# Altium schematic sheet TopSheet.SchDoc
size A
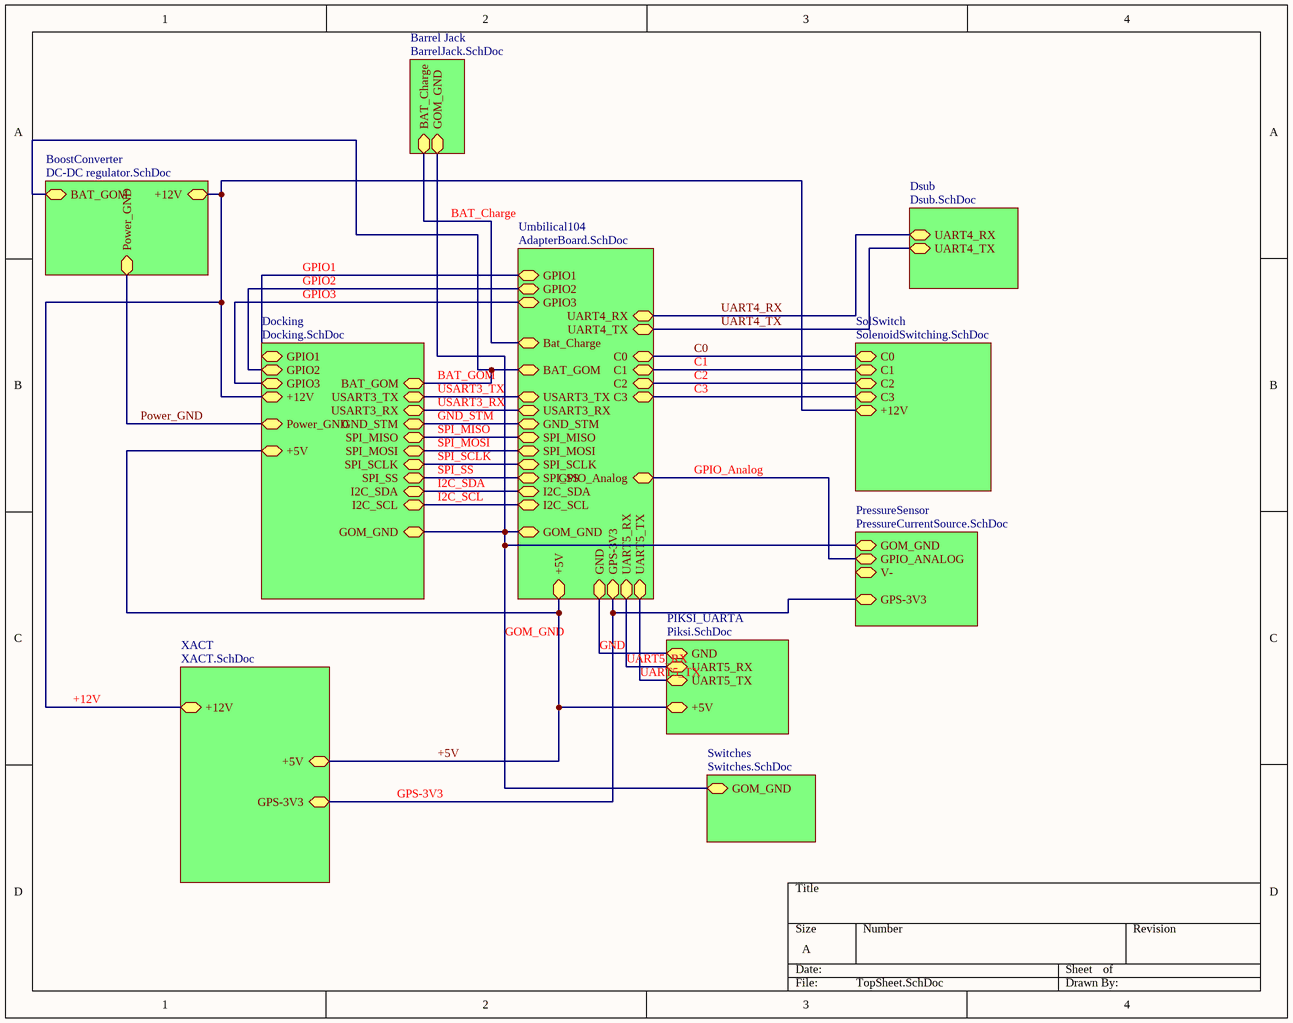
[diagram p0: TopSheet.SchDoc]

## Sub-sheets
Barrel Jack = BarrelJack.SchDoc: GOM_GND (bidir), BAT_Charge (bidir)
BoostConverter = DC-DC regulator.SchDoc: BAT_GOM (bidir), +12V (bidir), Power_GND (bidir)
Docking = Docking.SchDoc: GPIO3 (bidir), GPIO2 (bidir), GPIO1 (bidir), +12V (bidir), Power_GND (bidir), USART3_RX (bidir), GND_STM (bidir), SPI_SCLK (bidir), SPI_MISO (bidir), GOM_GND (bidir), BAT_GOM (bidir), I2C_SCL (bidir), SPI_MOSI (bidir), USART3_TX (bidir), SPI_SS (bidir), +5V (bidir), I2C_SDA (bidir)
Dsub = Dsub.SchDoc: UART4_TX (bidir), UART4_RX (bidir)
PIKSI_UARTA = Piksi.SchDoc: UART5_TX (bidir), UART5_RX (bidir), +5V (bidir), GND (bidir)
PressureSensor = PressureCurrentSource.SchDoc: GOM_GND (bidir), V- (bidir), GPIO_ANALOG (bidir), GPS-3V3 (bidir)
SolSwitch = SolenoidSwitching.SchDoc: C1 (bidir), C0 (bidir), C3 (bidir), C2 (bidir), +12V (bidir)
Switches = Switches.SchDoc: GOM_GND (bidir)
Umbilical104 = AdapterBoard.SchDoc: UART5_TX (bidir), C3 (bidir), UART4_RX (bidir), C2 (bidir), GOM_GND (bidir), SPI_MISO (bidir), C1 (bidir), SPI_SS (bidir), GND (bidir), SPI_SCLK (bidir), UART5_RX (bidir), GPS-3V3 (bidir), C0 (bidir), I2C_SDA (bidir), I2C_SCL (bidir), UART4_TX (bidir), SPI_MOSI (bidir), +5V (bidir), BAT_GOM (bidir), GND_STM (bidir), Bat_Charge (bidir), GPIO1 (bidir), GPIO3 (bidir), GPIO2 (bidir), USART3_RX (bidir), USART3_TX (bidir), GPIO_Analog (bidir)
XACT = XACT.SchDoc: GPS-3V3 (bidir), +12V (bidir), +5V (bidir)

## Nets
+5V: sheet Umbilical104/+5V, sheet XACT/+5V, sheet PIKSI_UARTA/+5V, sheet Docking/+5V
+12V: sheet BoostConverter/+12V, sheet SolSwitch/+12V, sheet XACT/+12V, sheet Docking/+12V
BAT_Charge: sheet Umbilical104/Bat_Charge, sheet Barrel Jack/BAT_Charge
BAT_GOM: sheet BoostConverter/BAT_GOM, sheet Umbilical104/BAT_GOM, sheet Docking/BAT_GOM
C0: sheet SolSwitch/C0, sheet Umbilical104/C0
C1: sheet SolSwitch/C1, sheet Umbilical104/C1
C2: sheet SolSwitch/C2, sheet Umbilical104/C2
C3: sheet SolSwitch/C3, sheet Umbilical104/C3
GND: sheet Umbilical104/GND, sheet PIKSI_UARTA/GND
GND_STM: sheet Umbilical104/GND_STM, sheet Docking/GND_STM
GOM_GND: sheet Umbilical104/GOM_GND, sheet Barrel Jack/GOM_GND, sheet PressureSensor/GOM_GND, sheet Switches/GOM_GND, sheet Docking/GOM_GND
GPIO1: sheet Umbilical104/GPIO1, sheet Docking/GPIO1
GPIO2: sheet Umbilical104/GPIO2, sheet Docking/GPIO2
GPIO3: sheet Umbilical104/GPIO3, sheet Docking/GPIO3
GPIO_Analog: sheet Umbilical104/GPIO_Analog, sheet PressureSensor/GPIO_ANALOG
GPS-3V3: sheet Umbilical104/GPS-3V3, sheet XACT/GPS-3V3, sheet PressureSensor/GPS-3V3
I2C_SCL: sheet Umbilical104/I2C_SCL, sheet Docking/I2C_SCL
I2C_SDA: sheet Umbilical104/I2C_SDA, sheet Docking/I2C_SDA
Power_GND: sheet BoostConverter/Power_GND, sheet Docking/Power_GND
SPI_MISO: sheet Umbilical104/SPI_MISO, sheet Docking/SPI_MISO
SPI_MOSI: sheet Umbilical104/SPI_MOSI, sheet Docking/SPI_MOSI
SPI_SCLK: sheet Umbilical104/SPI_SCLK, sheet Docking/SPI_SCLK
SPI_SS: sheet Umbilical104/SPI_SS, sheet Docking/SPI_SS
UART4_RX: sheet Umbilical104/UART4_RX, sheet Dsub/UART4_RX
UART4_TX: sheet Umbilical104/UART4_TX, sheet Dsub/UART4_TX
UART5_RX: sheet Umbilical104/UART5_RX, sheet PIKSI_UARTA/UART5_RX
UART5_TX: sheet Umbilical104/UART5_TX, sheet PIKSI_UARTA/UART5_TX
USART3_RX: sheet Umbilical104/USART3_RX, sheet Docking/USART3_RX
USART3_TX: sheet Umbilical104/USART3_TX, sheet Docking/USART3_TX